# EAGLE board Register_file (EAGLE 9.4.2), part 1 of 2
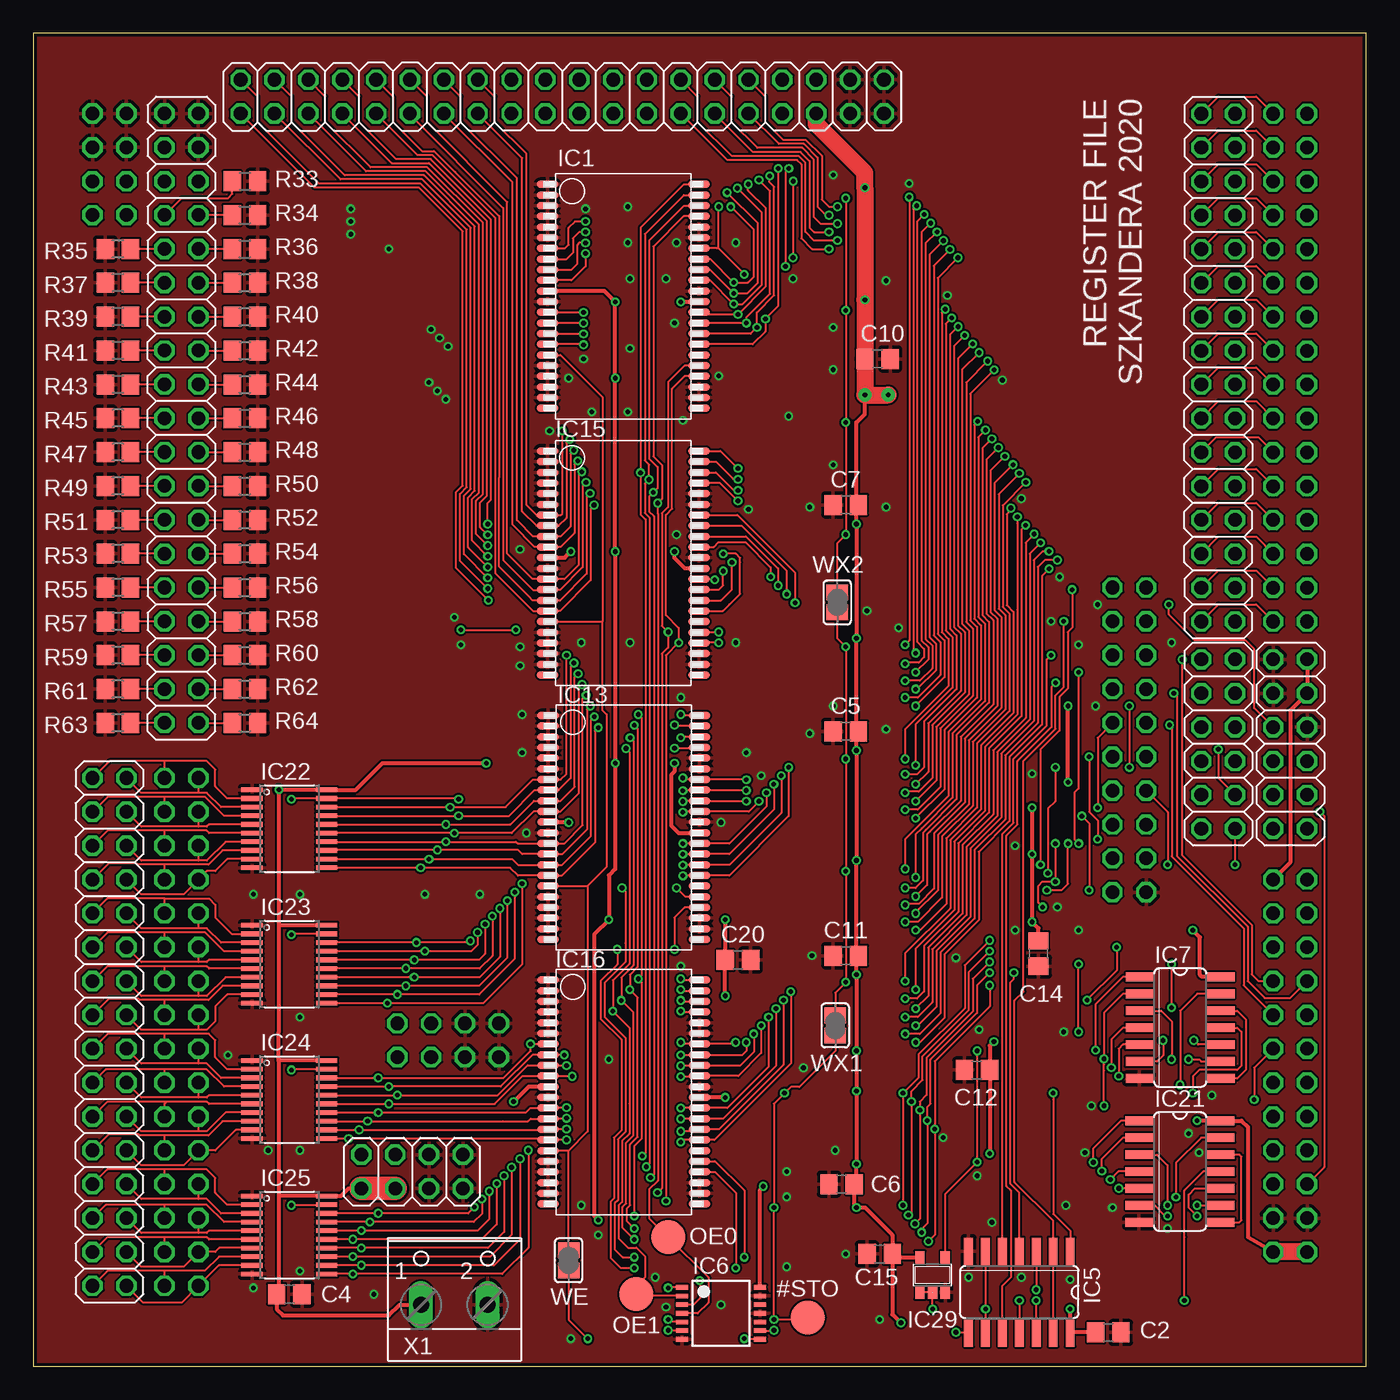
[diagram p2: board, top side]
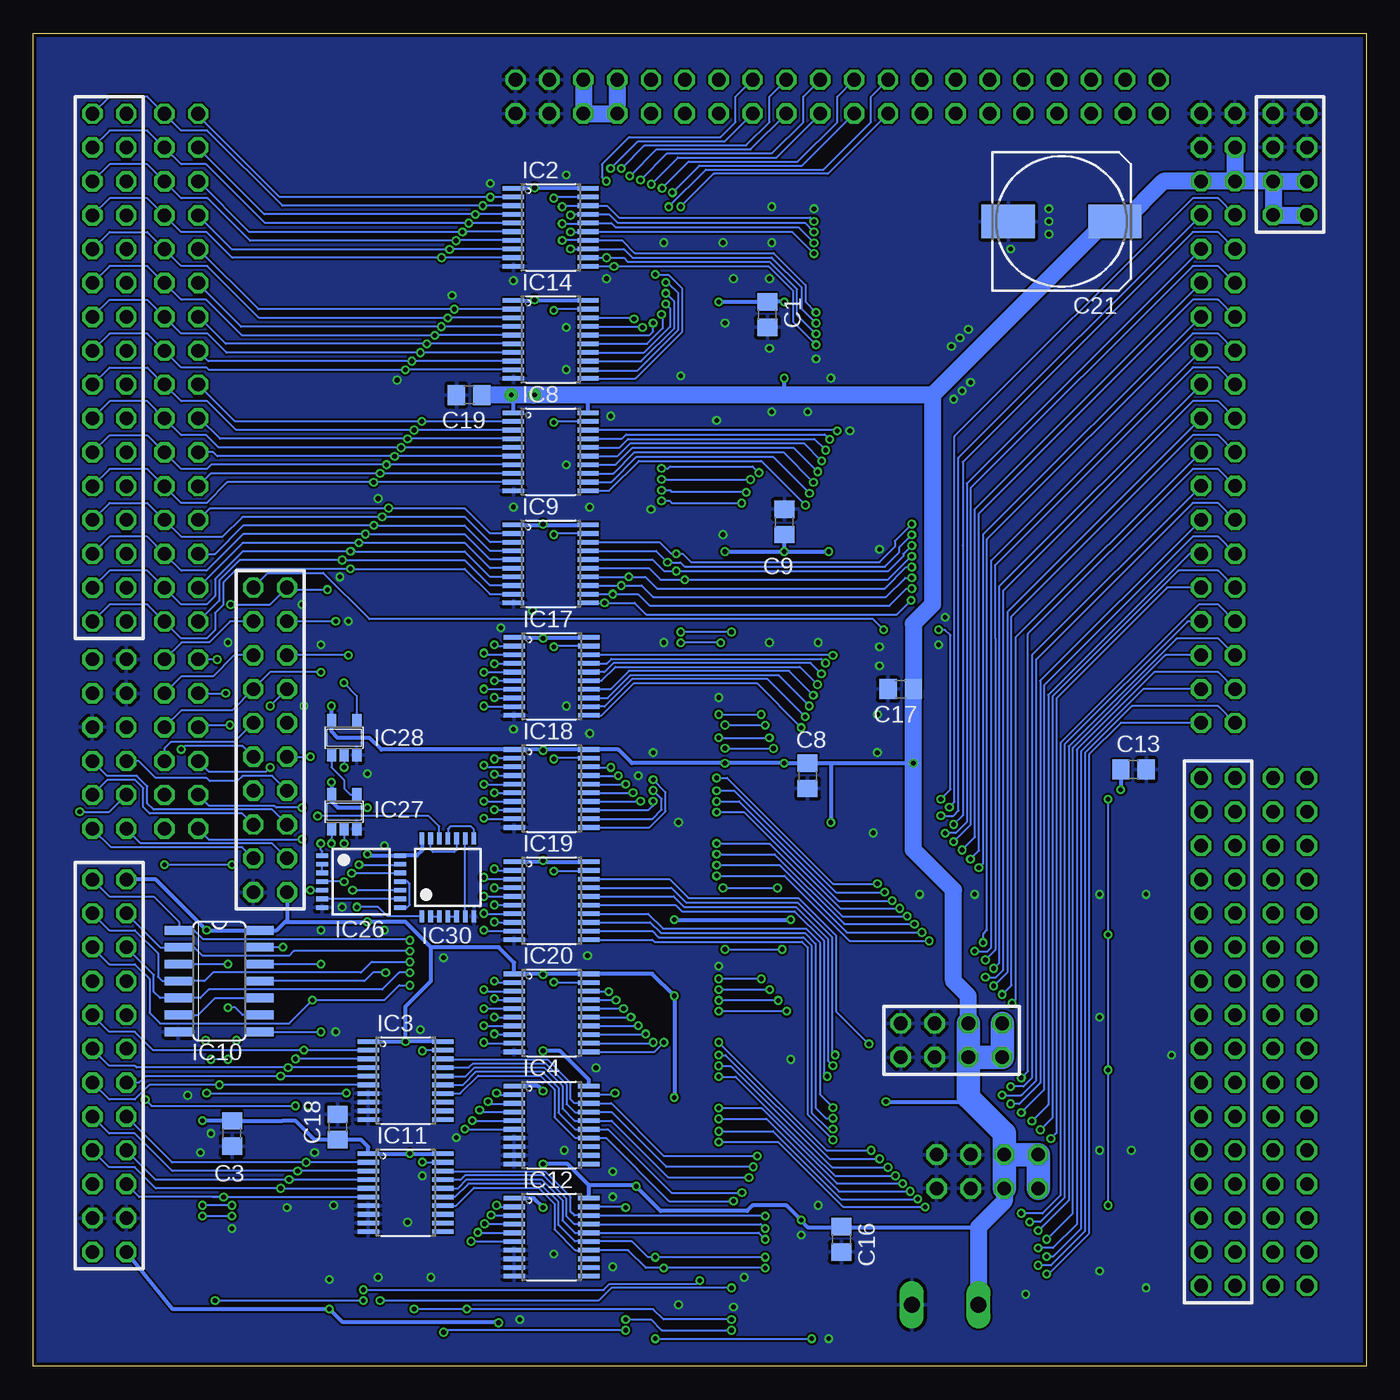
[diagram p3: board, bottom side, seen from below]

Size 100 x 100 mm. Coordinates in mm from the lower left corner, seen from the top.
Outline: 0,0 100,0 100,100 0,100 0,0
Copper layers (1*16): Top 0.035mm / dielectric 1.5mm / Bottom 0.035mm
Design rules "SeeedStudio_2layer_DRU_no_angle_20140221": minimum track width 6mil, minimum drill 12mil, track to track 6mil, track to pad 6mil, pad to pad 6mil, via to via 6mil, smd to smd 0mil, copper to edge 10mil, drill to drill 10mil, minimum pad ring 10mil, minimum via ring 6mil, stop-mask expansion 2mil, vias tented up to drill 100mil, thermal gap 10mil

## Footprints (pad centres in the part's own frame; a part is rotated, then mirrored left to right if it is on the bottom)
B2,54 = smd 2.54 x 2.54: TP 0,0
2X16 = drill 1.016 octagon: 1 -19.05,-1.27; 2 -19.05,1.27; 3 -16.51,-1.27; 4 -16.51,1.27; 5 -13.97,-1.27; 6 -13.97,1.27; 7 -11.43,-1.27; 8 -11.43,1.27; 9 -8.89,-1.27; 10 -8.89,1.27; 11 -6.35,-1.27; 12 -6.35,1.27; 13 -3.81,-1.27; 14 -3.81,1.27; 15 -1.27,-1.27; 16 -1.27,1.27; 17 1.27,-1.27; 18 1.27,1.27; 19 3.81,-1.27; 20 3.81,1.27; 21 6.35,-1.27; 22 6.35,1.27; 23 8.89,-1.27; 24 8.89,1.27; 25 11.43,-1.27; 26 11.43,1.27; 27 13.97,-1.27; 28 13.97,1.27; 29 16.51,-1.27; 30 16.51,1.27; 31 19.05,-1.27; 32 19.05,1.27
C0805 = smd 1.3 x 1.5: 1 -0.95,0; 2 0.95,0
153CLV-1010 = smd 4 x 2.5: + 4,0; - -4,0
TSOP-II-44 = smd 0.55 x 1.6: 1 -8.4,-5.68; 2 -7.6,-5.68; 3 -6.8,-5.68; 4 -6,-5.68; 5 -5.2,-5.68; 6 -4.4,-5.68; 7 -3.6,-5.68; 8 -2.8,-5.68; 9 -2,-5.68; 10 -1.2,-5.68; 11 -0.4,-5.68; 12 0.4,-5.68; 13 1.2,-5.68; 14 2,-5.68; 15 2.8,-5.68; 16 3.6,-5.68; 17 4.4,-5.68; 18 5.2,-5.68; 19 6,-5.68; 20 6.8,-5.68; 21 7.6,-5.68; 22 8.4,-5.68; 23 8.4,5.68; 24 7.6,5.68; 25 6.8,5.68; 26 6,5.68; 27 5.2,5.68; 28 4.4,5.68; 29 3.6,5.68; 30 2.8,5.68; 31 2,5.68; 32 1.2,5.68; 33 0.4,5.68; 34 -0.4,5.68; 35 -1.2,5.68; 36 -2,5.68; 37 -2.8,5.68; 38 -3.6,5.68; 39 -4.4,5.68; 40 -5.2,5.68; 41 -6,5.68; 42 -6.8,5.68; 43 -7.6,5.68; 44 -8.4,5.68
TSSOP20 = smd 0.35 x 1.6: 1 -2.925,-2.8; 2 -2.275,-2.8; 3 -1.625,-2.8; 4 -0.975,-2.8; 5 -0.325,-2.8; 6 0.325,-2.8; 7 0.975,-2.8; 8 1.625,-2.8; 9 2.275,-2.8; 10 2.925,-2.8; 11 2.925,2.8; 12 2.275,2.8; 13 1.625,2.8; 14 0.975,2.8; 15 0.325,2.8; 16 -0.325,2.8; 17 -0.975,2.8; 18 -1.625,2.8; 19 -2.275,2.8; 20 -2.925,2.8
SO14 = smd 0.66 x 2.032: 1 -3.81,-3.073; 2 -2.54,-3.073; 3 -1.27,-3.073; 4 0,-3.073; 5 1.27,-3.073; 6 2.54,-3.073; 7 3.81,-3.073; 8 3.81,3.073; 9 2.54,3.073; 10 1.27,3.073; 11 0,3.073; 12 -1.27,3.073; 13 -2.54,3.073; 14 -3.81,3.073
TSSOP14 = smd 0.35 x 0.9: 1 -1.95,-2.925; 2 -1.3,-2.925; 3 -0.65,-2.925; 4 0,-2.925; 5 0.65,-2.925; 6 1.3,-2.925; 7 1.95,-2.925; 8 1.95,2.925; 9 1.3,2.925; 10 0.65,2.925; 11 0,2.925; 12 -0.65,2.925; 13 -1.3,2.925; 14 -1.95,2.925
SOT23-5 = smd 0.69 x 0.99: 1 -0.95,-1.29; 2 0,-1.29; 3 0.95,-1.29; 4 0.95,1.3; 5 -0.95,1.3
2X12 = drill 1.016 octagon: 1 -13.97,-1.27; 2 -13.97,1.27; 3 -11.43,-1.27; 4 -11.43,1.27; 5 -8.89,-1.27; 6 -8.89,1.27; 7 -6.35,-1.27; 8 -6.35,1.27; 9 -3.81,-1.27; 10 -3.81,1.27; 11 -1.27,-1.27; 12 -1.27,1.27; 13 1.27,-1.27; 14 1.27,1.27; 15 3.81,-1.27; 16 3.81,1.27; 17 6.35,-1.27; 18 6.35,1.27; 19 8.89,-1.27; 20 8.89,1.27; 21 11.43,-1.27; 22 11.43,1.27; 23 13.97,-1.27; 24 13.97,1.27
2X04 = drill 1.016 octagon: 1 -3.81,-1.27; 2 -3.81,1.27; 3 -1.27,-1.27; 4 -1.27,1.27; 5 1.27,-1.27; 6 1.27,1.27; 7 3.81,-1.27; 8 3.81,1.27
R0805 = smd 1.3 x 1.5: 1 -0.95,0; 2 0.95,0
2X20 = drill 1.016 octagon: 1 -24.13,-1.27; 2 -24.13,1.27; 3 -21.59,-1.27; 4 -21.59,1.27; 5 -19.05,-1.27; 6 -19.05,1.27; 7 -16.51,-1.27; 8 -16.51,1.27; 9 -13.97,-1.27; 10 -13.97,1.27; 11 -11.43,-1.27; 12 -11.43,1.27; 13 -8.89,-1.27; 14 -8.89,1.27; 15 -6.35,-1.27; 16 -6.35,1.27; 17 -3.81,-1.27; 18 -3.81,1.27; 19 -1.27,-1.27; 20 -1.27,1.27; 21 1.27,-1.27; 22 1.27,1.27; 23 3.81,-1.27; 24 3.81,1.27; 25 6.35,-1.27; 26 6.35,1.27; 27 8.89,-1.27; 28 8.89,1.27; 29 11.43,-1.27; 30 11.43,1.27; 31 13.97,-1.27; 32 13.97,1.27; 33 16.51,-1.27; 34 16.51,1.27; 35 19.05,-1.27; 36 19.05,1.27; 37 21.59,-1.27; 38 21.59,1.27; 39 24.13,-1.27; 40 24.13,1.27
2X19 = drill 1.016 octagon: 1 -22.86,-1.27; 2 -22.86,1.27; 3 -20.32,-1.27; 4 -20.32,1.27; 5 -17.78,-1.27; 6 -17.78,1.27; 7 -15.24,-1.27; 8 -15.24,1.27; 9 -12.7,-1.27; 10 -12.7,1.27; 11 -10.16,-1.27; 12 -10.16,1.27; 13 -7.62,-1.27; 14 -7.62,1.27; 15 -5.08,-1.27; 16 -5.08,1.27; 17 -2.54,-1.27; 18 -2.54,1.27; 19 0,-1.27; 20 0,1.27; 21 2.54,-1.27; 22 2.54,1.27; 23 5.08,-1.27; 24 5.08,1.27; 25 7.62,-1.27; 26 7.62,1.27; 27 10.16,-1.27; 28 10.16,1.27; 29 12.7,-1.27; 30 12.7,1.27; 31 15.24,-1.27; 32 15.24,1.27; 33 17.78,-1.27; 34 17.78,1.27; 35 20.32,-1.27; 36 20.32,1.27; 37 22.86,-1.27; 38 22.86,1.27
2X10 = drill 1.016 octagon: 1 -11.43,-1.27; 2 -11.43,1.27; 3 -8.89,-1.27; 4 -8.89,1.27; 5 -6.35,-1.27; 6 -6.35,1.27; 7 -3.81,-1.27; 8 -3.81,1.27; 9 -1.27,-1.27; 10 -1.27,1.27; 11 1.27,-1.27; 12 1.27,1.27; 13 3.81,-1.27; 14 3.81,1.27; 15 6.35,-1.27; 16 6.35,1.27; 17 8.89,-1.27; 18 8.89,1.27; 19 11.43,-1.27; 20 11.43,1.27
2X06 = drill 1.016 octagon: 1 -6.35,-1.27; 2 -6.35,1.27; 3 -3.81,-1.27; 4 -3.81,1.27; 5 -1.27,-1.27; 6 -1.27,1.27; 7 1.27,-1.27; 8 1.27,1.27; 9 3.81,-1.27; 10 3.81,1.27; 11 6.35,-1.27; 12 6.35,1.27
SJ = smd 1.168 x 1.6: 1 -0.762,0; 2 0.762,0
W237-102 = drill 1.194 long: 1 -2.5,-1.27; 2 2.5,-1.27

## Placement (x,y rotation side)
#STO  PTR1B2,54  [B2,54]  58.1,3.65 0 top
ALU_Y_C0  [2X16]  11.11,25.08 270 top
ALU_Y_C1  [2X16]  5.71,25.08 270 top
C1  [C0805]  44.93,78.9 270 bottom
C2  [C0805]  80.64,2.54 0 top
C3  [C0805]  85.09,17.46 270 bottom
C4  [C0805]  19.21,5.4 0 top
C5  [C0805]  60.96,47.62 180 top
C6  [C0805]  60.64,13.65 180 top
C7  [C0805]  60.96,64.61 180 top
C8  [C0805]  41.91,44.29 270 bottom
C9  [C0805]  43.66,63.34 90 bottom
C10  [C0805]  63.34,75.56 0 top
C11  [C0805]  60.96,30.8 180 top
C12  [C0805]  70.8,22.23 180 top
C13  [C0805]  17.46,44.77 0 bottom
C14  [C0805]  75.41,30.96 270 top
C15  [C0805]  63.5,8.41 180 top
C16  [C0805]  39.37,9.53 270 bottom
C17  1u  [C0805]  34.92,50.8 180 bottom
C18  1u  [C0805]  77.15,17.94 90 bottom
C19  1u  [C0805]  67.31,72.87 180 bottom
C20  1u  [C0805]  52.86,30.48 0 top
C21  [153CLV-1010]  22.86,85.88 0 bottom
IC1  IS61C6416AL-12T  [TSOP-II-44]  44.26,80.26 270 top
IC2  74245  [TSSOP20]  61.18,85.44 270 bottom
IC3  74245  [TSSOP20]  72.07,21.43 270 bottom
IC4  74245  [TSSOP20]  61.12,18.1 270 bottom
IC5  74HCT08D  [SO14]  73.98,5.56 180 top
IC6  7404  [TSSOP14]  51.59,3.97 270 top
IC7  74HCT32D  [SO14]  86.04,25.4 270 top
IC8  74245  [TSSOP20]  61.18,68.61 270 bottom
IC9  74245  [TSSOP20]  61.18,60.2 270 bottom
IC10  74HCT32D  [SO14]  86.04,28.89 270 bottom
IC11  74245  [TSSOP20]  72.07,13.02 270 bottom
IC12  74245  [TSSOP20]  61.12,9.68 270 bottom
IC13  IS61C6416AL-12T  [TSOP-II-44]  44.31,40.42 270 top
IC14  74245  [TSSOP20]  61.18,77.03 270 bottom
IC15  IS61C6416AL-12T  [TSOP-II-44]  44.26,60.26 270 top
IC16  IS61C6416AL-12T  [TSOP-II-44]  44.31,20.57 270 top
IC17  74245  [TSSOP20]  61.12,51.75 270 bottom
IC18  74245  [TSSOP20]  61.12,43.34 270 bottom
IC19  74245  [TSSOP20]  61.12,34.92 270 bottom
IC20  74245  [TSSOP20]  61.12,26.51 270 bottom
IC21  74HCT32D  [SO14]  86.03,14.61 270 top
IC22  74245  [TSSOP20]  19.21,40.32 270 top
IC23  74245  [TSSOP20]  19.21,30.16 270 top
IC24  74245  [TSSOP20]  19.21,20 270 top
IC25  74245  [TSSOP20]  19.21,9.84 270 top
IC26  7404  [TSSOP14]  75.41,36.35 270 bottom
IC27  74AHC1G08DBV  [SOT23-5]  76.68,41.59 0 bottom
IC28  74AHC1G08DBV  [SOT23-5]  76.68,47.15 0 bottom
IC29  74AHC1G08DBV  [SOT23-5]  67.47,6.83 0 top
IC30  7404  [TSSOP14]  68.9,36.67 0 bottom
INS_C0  [2X12]  94.3,22.54 270 top
OE0  PTR1B2,54  [B2,54]  47.62,9.68 0 top
OE1  PTR1B2,54  [B2,54]  45.24,5.4 0 top
PWR1  [2X04]  5.71,90.17 90 top
PWR2  [2X04]  28.42,14.61 0 top
PWR3  [2X04]  31.11,24.45 0 top
R33  [R0805]  15.88,88.9 0 top
R34  [R0805]  15.88,86.36 0 top
R35  [R0805]  6.35,83.82 180 top
R36  [R0805]  15.88,83.82 0 top
R37  [R0805]  6.35,81.28 180 top
R38  [R0805]  15.88,81.28 0 top
R39  [R0805]  6.35,78.74 180 top
R40  [R0805]  15.88,78.74 0 top
R41  [R0805]  6.35,76.2 180 top
R42  [R0805]  15.88,76.2 0 top
R43  [R0805]  6.35,73.66 180 top
R44  [R0805]  15.88,73.66 0 top
R45  [R0805]  6.35,71.12 180 top
R46  [R0805]  15.88,71.12 0 top
R47  [R0805]  6.35,68.58 180 top
R48  [R0805]  15.88,68.58 0 top
R49  [R0805]  6.35,66.04 180 top
R50  [R0805]  15.88,66.04 0 top
R51  [R0805]  6.35,63.5 180 top
R52  [R0805]  15.88,63.5 0 top
R53  [R0805]  6.35,60.96 180 top
R54  [R0805]  15.88,60.96 0 top
R55  [R0805]  6.35,58.42 180 top
R56  [R0805]  15.88,58.42 0 top
R57  [R0805]  6.35,55.88 180 top
R58  [R0805]  15.88,55.88 0 top
R59  [R0805]  6.35,53.34 180 top
R60  [R0805]  15.88,53.34 0 top
R61  [R0805]  6.35,50.8 180 top
R62  [R0805]  15.88,50.8 0 top
R63  [R0805]  6.35,48.26 180 top
R64  [R0805]  15.88,48.26 0 top
RB0_C0  [2X20]  39.69,95.25 180 top
RB1_C0  [2X19]  11.11,71.12 270 top
RTB_BUS_C0  [2X16]  88.9,74.92 270 top
RTB_BUS_C1  [2X16]  94.3,74.92 270 top
SIGNAL_C0  [2X10]  82.23,46.99 270 top
SIGNAL_C1  [2X06]  88.9,46.67 270 top
SIGNAL_C2  [2X06]  94.3,46.67 270 top
WE  [SJ]  40.16,7.94 90 top
WX1  [SJ]  60.17,25.56 90 top
WX2  [SJ]  60.33,57.31 90 top
X1  [W237-102]  31.59,5.87 0 top

## Tracks (layer width: path | path; a pad name or v marks a point on that pad's centre or on a via)
#ALU_G  (via drill 0.35)
  Top 0.152: v82.23,49.53 v82.23,44.93
  Bottom 0.152: SIGNAL_C0.7 v82.23,49.53 | SIGNAL_C1.7 86.84,44.61 82.55,44.61 v82.23,44.93
#ALU_SRC_RF  (via drill 0.35)
  Top 0.152: v19.37,42.55 19.42,42.6 IC22.19 31.86,42.6 v31.91,42.55 | v19.37,12.06 19.42,12.12 IC25.19 | IC24.19 19.42,22.28 v19.37,22.23 | IC23.19 19.42,32.44 v19.37,32.38 | v32.07,55.24 v36.2,55.24
  Bottom 0.152: v19.37,42.55 v19.37,32.38 v19.37,22.23 v19.37,12.06 | SIGNAL_C0.2 82.41,59.52 78.25,59.52 74.77,56.04 36.99,56.04 v36.2,55.24 | v31.91,42.55 31.18,43.27 31.18,54.84 31.59,55.24 v32.07,55.24
#REG_RTB_G
  Bottom 0.152: SIGNAL_C0.10 84.93,46.83 89.69,46.83 90.17,46.35 SIGNAL_C1.8
#STO  (via drill 0.35)
  Top 0.152: v60.96,87.63 v60.96,79.22 v60.96,70.8 v60.96,62.39 60.33,61.75 WX2.2 WX2.1 60.33,54.61 v60.96,53.98 v60.96,45.56 v60.96,37.15 v60.96,28.8 60.17,28.01 WX1.2 WX1.1 60.17,23.65 57.47,20.95 56.83,20.95 v56.36,20.48 55.56,19.68 v55.56,11.91 v55.56,3.51 57.96,3.51 #STO.TP | v47.62,2.7 48.64,2.7 IC6.6
  Bottom 0.152: IC2.19 60.88,87.71 v60.96,87.63 | v60.96,37.15 58.37,37.15 IC19.19 | IC18.19 60.91,45.61 v60.96,45.56 | IC17.19 60.91,54.03 v60.96,53.98 | IC9.19 60.88,62.47 v60.96,62.39 | IC8.19 60.88,70.89 v60.96,70.8 | IC14.19 60.88,79.3 v60.96,79.22 | v60.96,28.8 60.94,28.79 IC20.19 | v56.36,20.48 56.36,20.37 IC4.19 | v55.56,11.91 55.56,11.96 IC12.19 | v55.56,3.51 53.67,3.51 52.86,2.7 v47.62,2.7
A0  (via drill 0.35)
  Top 0.152: IC15.44 51.56,68.66 v52.86,67.35 | v45.69,15.76 45.94,16.01 45.94,63.53 45.56,63.91 v45.56,67.04 45.56,85.42 48.8,88.66 IC1.44
  Bottom 0.152: v45.56,67.04 46.04,67.51 52.23,67.51 52.39,67.35 v52.86,67.35 | IC3.18 69.23,23.02 61.44,23.02 59.69,21.27 59.69,20 59.41,19.72 IC4.18 56.64,19.72 52.68,15.76 v45.69,15.76
A1  (via drill 0.35)
  Top 0.152: IC15.43 51.2,67.86 52.52,66.55 v52.86,66.55 | IC1.43 48.81,87.86 45.88,84.93 45.88,67.94 46.2,67.63 v46.2,66.52 45.89,66.21 45.89,64.01 46.25,63.65 46.25,15.21 v46,14.96
  Bottom 0.152: v52.86,66.55 52.83,66.52 v46.2,66.52 | IC3.17 67.33,22.41 67.03,22.71 61.56,22.71 59.99,21.15 59.99,19.67 59.37,19.05 58.34,19.05 IC4.17 56.62,19.07 52.51,14.96 v46,14.96
A2  (via drill 0.35)
  Top 0.152: IC15.42 51.21,67.06 52.55,65.72 v52.86,65.72 | IC1.42 48.8,87.06 46.2,84.45 46.2,68.1 46.83,67.47 46.83,65.88 v46.51,65.56 46.2,65.25 46.2,64.14 46.55,63.78 46.55,14.4 v46.3,14.15
  Bottom 0.152: v46.51,65.56 46.58,65.63 52.14,65.63 52.23,65.72 v52.86,65.72 | IC3.16 67.55,21.76 66.9,22.41 61.69,22.41 60.3,21.02 60.3,19.34 59.38,18.42 IC4.16 56.61,18.42 52.33,14.15 v46.3,14.15
A3  (via drill 0.35)
  Top 0.152: IC1.27 48.87,75.06 47.62,73.82 47.62,64.45 47.16,63.99 47.16,55.55 v47.62,55.09 47.62,53.92 47.16,53.45 47.16,13.35 v46.83,13.02 | v51.44,55.09 51.41,55.06 IC15.27
  Bottom 0.152: IC3.15 67.77,21.11 66.77,22.1 61.81,22.1 60.6,20.89 60.6,19.01 59.37,17.77 IC4.15 56.89,17.77 52.13,13.02 v46.83,13.02 | v47.62,55.09 v51.44,55.09
A4  (via drill 0.35)
  Top 0.152: IC1.26 48.86,74.26 47.93,73.33 47.93,64.33 47.47,63.86 47.47,56.34 48.42,55.39 v48.42,54.28 47.47,53.33 v47.47,12.38 | v51.44,54.28 49.96,54.28 IC15.26
  Bottom 0.152: IC3.14 67.97,20.46 66.62,21.8 61.94,21.8 60.91,20.77 60.91,18.68 59.35,17.12 IC4.14 57.05,17.12 52.31,12.38 v47.47,12.38 | v48.42,54.28 v51.44,54.28
A10  (via drill 0.35)
  Top 0.152: IC13.44 48.66,48.82 v48.58,48.9 | v45.39,48.9 45.64,48.64 45.64,29.3 v45.39,29.05 45.64,28.8 45.64,19.21 45.64,17.06 45.24,16.67 45.09,16.51 v45.09,11.27 | v48.58,29.05 48.66,28.97 IC16.44
  Bottom 0.152: IC11.18 69.24,14.61 61.6,14.61 59.69,12.7 59.69,11.59 59.41,11.31 IC12.18 58.28,11.27 v45.09,11.27 | v48.58,48.9 v45.39,48.9 | v45.39,29.05 v48.58,29.05
A11  (via drill 0.35)
  Top 0.152: IC13.43 48.19,48.02 v48.1,48.1 | v45.08,48.09 45.33,47.84 45.33,29.94 44.75,29.36 v44.75,28.24 45.33,27.66 45.33,17.19 44.78,16.64 44.78,12.08 44.53,11.83 44.53,10.88 v45.09,10.32 | v48.58,28.24 48.65,28.17 IC16.43
  Bottom 0.152: IC11.17 69.25,13.97 67.94,13.97 67.61,14.3 61.73,14.3 59.99,12.57 59.99,11.26 59.4,10.66 IC12.17 45.42,10.66 v45.09,10.32 | v48.1,48.1 45.09,48.1 v45.08,48.09 | v44.75,28.24 v48.58,28.24
A12  (via drill 0.35)
  Top 0.152: IC13.42 48.65,47.22 v48.58,47.15 | v44.78,47.15 45.03,46.9 45.03,30.07 44.12,29.16 v44.12,27.44 45.03,26.52 45.03,17.32 44.48,16.76 44.48,12.2 44.22,11.95 44.22,10.37 v45.09,9.51 | v48.58,27.44 48.64,27.37 IC16.42
  Bottom 0.152: IC11.16 68.14,13.34 67.48,14 61.85,14 60.3,12.45 60.3,10.93 59.37,10 IC12.16 45.58,10.01 v45.09,9.51 | v48.58,47.15 v44.78,47.15 | v44.12,27.44 v48.58,27.44
A13  (via drill 0.35)
  Top 0.152: IC13.27 48.92,35.22 v48.26,35.88 | v44.17,35.88 44.42,35.63 44.42,31.75 44.42,30.32 43.64,29.54 42.86,28.77 42.86,26.67 42.86,26.19 43.5,25.56 44.42,24.64 44.42,17.57 43.87,17.02 43.87,12.46 43.62,12.21 43.62,8.77 44.21,8.18 v45.09,8.18 | IC16.27 51.14,15.37 53.34,13.18 v53.34,8.18
  Bottom 0.152: IC11.15 68.36,12.69 67.36,13.7 61.98,13.7 60.6,12.32 60.6,10.6 59.37,9.36 IC12.15 55.09,9.37 53.9,8.18 v53.34,8.18 v45.09,8.18 | v48.26,35.88 v44.17,35.88
A14  (via drill 0.35)
  Top 0.152: IC13.26 48.86,34.42 48.1,33.66 v48.1,31.27 | v43.81,31.27 43.81,30.15 42.56,28.89 42.56,26.07 44.11,24.51 44.11,17.69 43.56,17.14 43.56,12.58 43.31,12.33 43.31,8.12 44.07,7.37 v45.09,7.37 | IC16.26 51.15,14.57 52.7,13.02 v52.7,7.37
  Bottom 0.152: IC11.14 68.28,12.04 66.94,13.39 62.1,13.39 60.91,12.2 60.91,10.27 59.35,8.71 IC12.14 55.38,8.71 54.04,7.37 v52.7,7.37 v45.09,7.37 | v48.1,31.27 v43.81,31.27
ALU_OP_0
  Bottom 0.152: SIGNAL_C0.18 84.32,38.92 94.16,38.92 SIGNAL_C2.12
ALU_OP_1
  Bottom 0.152: SIGNAL_C0.16 84.32,41.46 91.26,41.46 91.75,41.94 91.75,43.37 92.36,43.99 94.44,43.99 SIGNAL_C2.10
ALU_Y_0
  Top 0.152: IC22.2 14.55,42.6 13.65,43.5 13.65,44.77 13.02,45.4 9.84,45.4 | 9.84,45.4 5.71,45.4 ALU_Y_C1.1 | ALU_Y_C0.1 9.84,45.4
ALU_Y_1
  Top 0.152: IC22.3 14.09,41.95 13.02,43.02 12.38,43.02 | 12.38,43.02 8.1,43.02 ALU_Y_C1.2 | ALU_Y_C0.2 12.38,43.02
ALU_Y_2
  Top 0.152: IC22.4 14.31,41.3 12.89,42.72 9.84,42.72 | 9.84,42.72 5.57,42.72 ALU_Y_C1.3 | ALU_Y_C0.3 9.84,42.72
ALU_Y_3
  Top 0.152: IC22.5 13.18,40.65 13.02,40.48 12.38,40.48 | 12.38,40.48 8.1,40.48 ALU_Y_C1.4 | ALU_Y_C0.4 12.38,40.48
ALU_Y_4
  Top 0.152: IC22.6 13.18,40 13.01,40.18 9.84,40.18 | ALU_Y_C1.5 5.57,40.18 9.84,40.18 | ALU_Y_C0.5 9.84,40.18
ALU_Y_5
  Top 0.152: IC22.7 14.42,39.35 13.02,37.94 12.38,37.94 | 12.38,37.94 8.1,37.94 ALU_Y_C1.6 | ALU_Y_C0.6 12.38,37.94
ALU_Y_6
  Top 0.152: IC22.8 14.21,38.7 13.14,37.64 9.84,37.64 | ALU_Y_C1.7 5.66,37.73 7.72,37.73 7.81,37.64 9.84,37.64 | ALU_Y_C0.7 9.84,37.64
ALU_Y_7
  Top 0.152: IC22.9 14.55,38.05 13.65,37.15 13.02,37.15 ALU_Y_C0.8 11.27,35.4 8.1,35.4 ALU_Y_C1.8
ALU_Y_8
  Top 0.152: 9.84,35.08 5.56,35.08 ALU_Y_C1.9 | ALU_Y_C0.9 9.84,35.08 | 9.84,35.08 13.18,35.08 13.65,34.61 13.65,33.66 14.87,32.44 IC23.2
ALU_Y_9
  Top 0.152: IC23.3 14.09,31.79 13.02,32.86 12.38,32.86 | 12.38,32.86 8.1,32.86 ALU_Y_C1.10 | ALU_Y_C0.10 12.38,32.86
ALU_Y_10
  Top 0.152: IC23.4 14.31,31.14 12.89,32.56 9.84,32.56 | 9.84,32.56 5.57,32.56 ALU_Y_C1.11 | ALU_Y_C0.11 9.84,32.56
ALU_Y_11
  Top 0.152: IC23.5 13.18,30.49 13.02,30.32 12.38,30.32 | 12.38,30.32 8.1,30.32 ALU_Y_C1.12 | ALU_Y_C0.12 12.38,30.32
ALU_Y_12
  Top 0.152: IC23.6 13.18,29.84 13.02,30 9.84,30 | 9.84,30 5.56,30 ALU_Y_C1.13 | ALU_Y_C0.13 9.84,30
ALU_Y_13
  Top 0.152: IC23.7 14.42,29.19 13.02,27.78 12.38,27.78 | 12.38,27.78 8.1,27.78 ALU_Y_C1.14 | ALU_Y_C0.14 12.38,27.78
ALU_Y_14
  Top 0.152: IC23.8 14.21,28.54 13.14,27.48 9.84,27.48 | ALU_Y_C1.15 5.66,27.57 7.88,27.57 7.97,27.48 9.84,27.48 | ALU_Y_C0.15 9.84,27.48
ALU_Y_15
  Top 0.152: IC23.9 14.55,27.89 13.65,26.99 13.65,25.88 13.02,25.24 12.38,25.24 | 12.38,25.24 8.1,25.24 ALU_Y_C1.16 | ALU_Y_C0.16 12.38,25.24
ALU_Y_16
  Top 0.152: IC24.2 14.55,22.28 13.65,23.18 13.65,24.45 13.16,24.94 9.84,24.94 | ALU_Y_C1.17 5.57,24.94 9.84,24.94 | ALU_Y_C0.17 9.84,24.94
ALU_Y_17
  Top 0.152: IC24.3 14.09,21.63 13.02,22.7 12.38,22.7 | 12.38,22.7 8.1,22.7 ALU_Y_C1.18 | ALU_Y_C0.18 12.38,22.7
ALU_Y_18
  Top 0.152: IC24.4 14.31,20.98 13.03,22.26 9.84,22.26 | 9.84,22.26 5.44,22.26 ALU_Y_C1.19 | ALU_Y_C0.19 9.84,22.26
ALU_Y_19
  Top 0.152: IC24.5 13.18,20.33 13.02,20.16 12.38,20.16 | 12.38,20.16 8.1,20.16 ALU_Y_C1.20 | ALU_Y_C0.20 12.38,20.16
ALU_Y_20
  Top 0.152: IC24.6 13.18,19.68 13.02,19.84 10,19.84 | 10,19.84 5.56,19.84 ALU_Y_C1.21 | ALU_Y_C0.21 9.84,19.68 10,19.84
ALU_Y_21
  Top 0.152: IC24.7 14.42,19.03 13.02,17.62 12.38,17.62 | 12.38,17.62 8.1,17.62 ALU_Y_C1.22 | ALU_Y_C0.22 12.38,17.62
ALU_Y_22
  Top 0.152: IC24.8 14.21,18.38 13.14,17.32 9.84,17.32 | ALU_Y_C1.23 5.66,17.41 7.88,17.41 7.97,17.32 9.84,17.32 | ALU_Y_C0.23 9.84,17.32
ALU_Y_23
  Top 0.152: IC24.9 15.19,17.73 13.65,16.19 ALU_Y_C0.24 11.27,15.08 8.1,15.08 ALU_Y_C1.24
ALU_Y_24
  Top 0.152: IC25.2 14.55,12.12 13.65,13.02 13.65,14.13 13.02,14.76 9.84,14.76 | 9.84,14.76 5.56,14.76 ALU_Y_C1.25 | ALU_Y_C0.25 9.84,14.76
ALU_Y_25
  Top 0.152: IC25.3 14.09,11.47 13.02,12.54 12.38,12.54 | 12.38,12.54 8.1,12.54 ALU_Y_C1.26 | ALU_Y_C0.26 12.38,12.54
ALU_Y_26
  Top 0.152: IC25.4 14.31,10.82 13.03,12.1 9.84,12.1 | 9.84,12.1 5.44,12.1 ALU_Y_C1.27 | ALU_Y_C0.27 9.84,12.1
ALU_Y_27
  Top 0.152: IC25.5 13.18,10.17 13.02,10 12.38,10 | 12.38,10 8.1,10 ALU_Y_C1.28 | ALU_Y_C0.28 12.38,10
ALU_Y_28
  Top 0.152: IC25.6 13.18,9.52 13.02,9.68 9.84,9.68 | 9.84,9.68 5.56,9.68 ALU_Y_C1.29 | ALU_Y_C0.29 9.84,9.68
ALU_Y_29
  Top 0.152: IC25.7 13.95,8.87 13.65,8.57 ALU_Y_C0.30 11.27,7.46 8.1,7.46 ALU_Y_C1.30
ALU_Y_30
  Top 0.152: IC25.8 13.93,8.22 12.87,7.16 9.84,7.16 | ALU_Y_C1.31 5.57,7.16 9.84,7.16 | ALU_Y_C0.31 9.84,7.16
ALU_Y_31
  Top 0.152: IC25.9 13.92,7.57 ALU_Y_C0.32 11.11,4.76 8.26,4.76 ALU_Y_C1.32
BRANCH
  Bottom 0.152: SIGNAL_C0.15 82.09,41.76 90.98,41.76 91.44,42.23 91.44,43.5 92.23,44.29 94.46,44.29 SIGNAL_C2.8
CLK  (via drill 0.35)
  Top 0.152: v78.42,52.07 78.42,43.34 78.12,43.03 78.12,39.53 v78.44,39.21
  Bottom 0.152: SIGNAL_C1.6 88.9,49.21 85.09,49.21 SIGNAL_C0.8 82.23,52.07 v78.42,52.07 | IC26.1 78.33,38.63 78.44,38.73 v78.44,39.21
GND  (via drill 0.35)
  other vias: 79.69,49.53 73.66,39.05 73.66,32.7 78.42,32.7 77.31,25.08 69.22,30.64 78.9,16.03 70.8,14.29 68.26,17.14 86.68,17.46 88.42,20.32 85.09,10.32 71.91,10.79 77.47,12.06 63.5,3.49 77.79,6.51 70.17,6.67 60.96,8.41 56.52,7.46 51.59,4.6 46.67,6.67 47.47,4.45 40.32,2.06 42.39,9.84 41.12,12.06 16.51,5.87 20,7.14 25.56,5.4 20,16.19 17.62,16.19 14.61,23.34 20,26.19 16.51,35.4 20,35.4 29.37,35.4 33.5,35.4 36.99,40.01 48.58,50.16 53.5,46.04 54.61,44.29 36.67,48.9 36.67,46.04 36.51,52.55 36.51,53.98 31.59,56.2 41.12,54.29 44.77,54.29 52.7,54.29 60.01,49.53 63.98,47.78 58.26,47.47 62.55,56.67 64.93,55.4 63.98,64.45 58.26,64.45 53.66,64.29 48.26,62.39 48.74,70.96 51.44,74.3 48.1,78.26 44.77,76.36 41.27,75.56 44.77,81.6 47.47,81.6 44.61,84.3 48.26,84.3 31.11,76.52 30.48,77.15 29.84,77.79 29.69,73.82 30.32,73.18 30.96,72.55 41.43,86.84 44.61,87 52.7,84.3 56.99,81.6 60.01,89.38 63.98,81.44 72.71,73.98 36.51,61.28 32.07,54.13 38.73,70.17 40.16,74.14 41.91,71.6 44.61,71.6 60.01,77.95 60.01,74.77 56.67,71.28 60.01,67.63 68.58,80.33 65.72,88.74 74.14,65.09 76.99,59.21 76.36,55.88 78.42,54.13 76.83,34.45 80.96,11.91 87.47,16.03 79.38,19.53 70.96,25.24 48.58,30 58.42,30.8 57.78,22.38 56.52,14.61 56.52,12.7 60.17,16.19 74.14,6.67 51.59,40.8 43.18,23.02 74.93,44.45 79.85,57.15 85.41,54.29 23.81,86.84 23.81,85.88 23.81,84.93 26.67,83.82
  pour Top: -6.83,107.95 107.16,107.95 107.16,43.02 107.16,-7.78 42.55,-7.78 -6.83,-7.78
  pour Bottom: -8.1,109.38 -8.1,-9.53 104.78,-9.53 108.11,-9.53 108.11,-5.08 108.11,109.38
INS_F3_0  (via drill 0.35)
  Top 0.152: v86.2,53.02 86.2,38.33 91.42,33.11 91.42,29.39 91.92,28.89 INS_C0.7
  Bottom 0.152: v86.2,53.02 SIGNAL_C1.1
INS_F3_1  (via drill 0.35)
  Top 0.152: v85.57,50.48 85.81,50.24 85.81,38.29 91.11,32.99 91.11,28.91 92.39,27.62 94.3,27.62 INS_C0.8
  Bottom 0.152: SIGNAL_C1.3 v85.57,50.48
INS_F3_2  (via drill 0.35)
  Top 0.152: v85.25,48.1 85.41,47.94 85.41,38.26 90.81,32.86 90.81,28.57 INS_C0.9
  Bottom 0.152: v85.25,48.1 87.47,48.1 SIGNAL_C1.5
INS_I  (via drill 0.35)
  Top 0.152: INS_C0.20 96.84,14.92 96.84,41.27 v96.52,41.59
  Bottom 0.152: v96.52,41.59 94.3,41.59 SIGNAL_C2.9
INS_R1_0  (via drill 0.35)
  Top 0.152: IC7.1 81.76,29.21 79.69,27.15 v79.69,23.71
  Bottom 0.152: IC3.2 v79.69,23.71 91.02,23.71 92.39,25.08 94.3,25.08 INS_C0.10
INS_R1_1  (via drill 0.35)
  Top 0.152: IC7.2 81.76,27.94 80.33,26.51 v80.33,23.06 v80.33,23.05 80.33,22.64 80.33,22.18 v80.33,19.53 | INS_C0.11 91.6,22.38 v91.6,20
  Bottom 0.152: IC3.3 v80.33,23.06 | v91.6,20 91.12,19.53 v80.33,19.53
INS_R1_2  (via drill 0.35)
  Top 0.152: IC7.4 81.76,25.4 80.88,24.53 v80.88,22.41
  Bottom 0.152: IC3.4 v80.88,22.41 92.26,22.41 92.39,22.54 94.3,22.54 INS_C0.12
INS_R1_3  (via drill 0.35)
  Top 0.152: IC7.5 81.76,24.13 81.44,23.81 v81.44,21.76
  Bottom 0.152: IC3.5 v81.44,21.76 91.59,21.76 92.08,21.27 INS_C0.13
INS_R1_4  (via drill 0.35)
  Top 0.152: IC7.13 87.31,27.94 86.04,26.67 v86.04,21.11
  Bottom 0.152: IC3.6 v86.04,21.11 91.29,21.11 92.39,20 94.3,20 INS_C0.14
INS_R2_0  (via drill 0.35)
  Top 0.152: IC21.1 81.6,18.41 79.53,16.35 v79.53,15.29
  Bottom 0.152: IC11.2 v79.53,15.29 89.59,15.29 INS_C0.15
INS_R2_1  (via drill 0.35)
  Top 0.152: IC21.2 81.76,17.14 80.17,15.56 v80.17,14.64
  Bottom 0.152: IC11.3 v80.17,14.64 89.57,14.64 92.39,17.46 94.3,17.46 INS_C0.16
INS_R2_2  (via drill 0.35)
  Top 0.152: IC21.4 81.42,14.61 v80.8,13.99
  Bottom 0.152: IC11.4 v80.8,13.99 90.83,13.99 INS_C0.17
INS_R2_3  (via drill 0.35)
  Top 0.152: IC21.5 v81.45,13.34 v81.44,13.34
  Bottom 0.152: IC11.5 v81.44,13.34 90.81,13.34 92.39,14.92 94.3,14.92 INS_C0.18
INS_R2_4  (via drill 0.35)
  Top 0.152: IC21.13 87.63,17.14 85.72,15.24 v85.72,12.69
  Bottom 0.152: 86.52,12.69 IC11.6 | v85.72,12.69 86.52,12.69 | 86.52,12.69 92.07,12.69 INS_C0.19
INS_WR_0  (via drill 0.35)
  Top 0.152: v65.25,12.06 v65.25,20.48 66.41,21.64 66.41,23.39 69.88,26.85 69.88,30.07 v71.75,31.95
  Bottom 0.152: v65.25,20.48 65.14,20.37 IC4.2 | v65.25,12.06 65.14,11.96 IC12.2 | INS_C0.2 94.3,35.24 90.96,35.24 89.06,33.34 89.06,32.7 | 89.06,32.7 87.95,32.7 87.31,32.07 71.87,32.07 v71.75,31.95 | 89.06,32.7 IC10.1
INS_WR_1  (via drill 0.35)
  Top 0.152: v65.66,11.34 65.88,11.56 v65.88,19.84 65.88,20.64 66.71,21.47 66.71,23.26 70.18,26.73 70.18,29.57 v71.75,31.14
  Bottom 0.152: IC4.3 63.96,19.68 65.72,19.68 v65.88,19.84 | v65.66,11.34 63.95,11.34 IC12.3 | v71.75,31.14 80.46,31.14 80.8,30.8 87.31,30.8 87.95,31.43 IC10.2 90.49,31.43 INS_C0.3
INS_WR_2  (via drill 0.35)
  Top 0.152: v66.15,10.69 66.52,11.05 v66.52,19.21 66.52,19.84 67.02,20.35 67.02,23.14 70.48,26.6 70.48,29.07 v71.75,30.34
  Bottom 0.152: v66.52,19.21 66.38,19.07 IC4.4 | v66.15,10.69 63.95,10.69 IC12.4 | v71.75,30.34 74.61,30.34 75.42,29.53 86.52,29.53 87.15,28.89 IC10.4 90.33,28.89 90.65,29.21 90.65,30.96 92.39,32.7 94.3,32.7 INS_C0.4
INS_WR_3  (via drill 0.35)
  Top 0.152: v66.64,10.04 66.64,10.29 67.07,10.72 v67.07,18.41 67.07,19.45 67.32,19.7 67.32,23.01 70.8,26.49 70.8,28.57 v71.75,29.53
  Bottom 0.152: IC4.5 v67.07,18.41 | v66.64,10.04 66.61,10.01 IC12.5 | v71.75,29.53 72.55,29.53 73.82,28.26 86.84,28.26 87.47,27.62 IC10.5 90.49,27.62 90.96,28.1 90.96,29.37 INS_C0.5
INS_WR_4  (via drill 0.35)
  Top 0.152: v71.75,28.57 71.75,27.01 67.63,22.88 v67.63,17.78 67.63,9.84 v67.15,9.37 | v81.28,31.43 81.28,29.69 v79.06,27.46
  Bottom 0.152: IC4.6 v67.63,17.78 | v71.75,28.57 72.55,28.57 73.66,27.46 v79.06,27.46 80.8,25.72 85.1,25.72 90.49,25.72 91.28,26.51 91.28,29.05 92.39,30.16 94.3,30.16 INS_C0.6 | IC12.6 v67.15,9.37 | v81.28,31.43 IC10.13
IS_ZERO  (via drill 0.35)
  Top 0.152: IC5.4 73.98,13.02 73.32,13.68 73.32,28.8 73.57,29.05 v73.57,29.53
  Bottom 0.152: v73.57,29.53 74.52,29.53 75.16,28.89 IC10.11
IS_ZERO_R1  (via drill 0.35)
  Top 0.152: IC7.11 90.33,25.4 90.65,25.08 90.65,22.54 90.33,22.23 87.47,22.23 87,21.75 v87,20.48 | v76.52,20.48 76.52,20 76.52,11.43 77.79,10.16 IC5.1
  Bottom 0.152: v87,20.48 v76.52,20.48
IS_ZERO_R2  (via drill 0.35)
  Top 0.152: IC21.11 87.79,14.61 86.37,13.19 86.37,9.7 86.36,9.68 v86.36,4.92 | IC5.12 v75.25,4.92
  Bottom 0.152: v75.25,4.92 v86.36,4.92
LTCH_CLK  (via drill 0.35)
  Top 0.152: SIGNAL_C0.9 79.85,47.15 v79.85,41.91
  Bottom 0.152: v79.85,41.91 81.76,41.91 81.92,42.07 86.84,42.07 SIGNAL_C1.9
M0_OE  (via drill 0.35)
  Top 0.152: IC1.41 48.8,86.26 46.53,83.99 46.53,68.25 47.16,67.61 47.16,65.07 v46.85,64.75 46.85,63.96 46.86,63.95 46.86,13.92 46.2,13.26 46.2,11.11 OE0.TP 50.64,6.67 50.64,4.76 49.85,3.97 IC6.4 | v52.86,64.92 51.52,66.26 IC15.41
  Bottom 0.152: v46.85,64.75 52.09,64.75 52.25,64.92 v52.86,64.92
M0_WE  (via drill 0.35)
  Top 0.152: IC1.17 39.55,75.86 42.7,72.71 42.7,55.88 42.69,55.86 | IC15.17 42.69,55.86 | 42.69,55.86 42.69,49.23 43.02,48.9 43.02,37.47 41.57,36.02 | IC13.17 41.57,36.02 | 41.57,36.02 41.59,36 41.59,17.6 40.16,16.17 | 40.16,16.17 IC16.17 | IC6.8 53.38,2.02 v53.34,2.06 | 40.16,16.17 WE.2 WE.1 40.16,3.49 v41.59,2.06
  Bottom 0.152: v53.34,2.06 v41.59,2.06
M1_OE  (via drill 0.35)
  Top 0.152: IC13.41 49.93,46.35 v48.1,46.35 | v44.47,46.34 44.72,46.09 44.72,30.2 43.48,28.95 v43.48,26.63 44.72,25.39 44.72,19.68 44.72,17.44 44.17,16.89 44.17,12.33 43.92,12.08 43.92,10.21 43.92,9.58 44.61,8.89 45.24,8.89 45.88,8.26 45.88,6.67 45.24,6.03 OE1.TP 45.37,5.27 IC6.2 | v48.58,26.63 48.63,26.57 IC16.41
  Bottom 0.152: v48.1,46.35 48.09,46.34 v44.47,46.34 | v43.48,26.63 v48.58,26.63
MEM_LOAD
  Bottom 0.152: SIGNAL_C0.6 84.93,53.34 86.52,51.75 88.9,51.75 SIGNAL_C1.4
MEM_STORE
  Bottom 0.152: SIGNAL_C0.4 85.25,55.88 86.82,54.3 88.89,54.3 SIGNAL_C1.2
N$1  (via drill 0.35)
  Top 0.152: v85.41,23.02 85.41,25.88 84.61,26.67 IC7.3 | v86.68,23.02 87.47,23.02 87.63,22.86 IC7.9
  Bottom 0.152: v85.41,23.02 v86.68,23.02
N$2  (via drill 0.35)
  Top 0.152: IC7.10 87.39,24.13 v87.08,24.45 | v84.77,24.45 84.77,23.34 84.3,22.86 IC7.6
  Bottom 0.152: v87.08,24.45 v84.77,24.45
N$3  (via drill 0.35)
  Top 0.152: v85.41,26.91 v85.41,30.16
  Bottom 0.152: IC10.9 84.3,26.35 84.85,26.91 v85.41,26.91 | v85.41,30.16 IC10.3
N$4
  Bottom 0.152: IC10.6 87.63,26.35 86.36,27.62 IC10.10
N$5  (via drill 0.35)
  Top 0.152: v78.42,25.08 v78.42,30.16
  Bottom 0.152: IC10.8 v78.42,25.08 | v78.42,30.16 IC10.12
N$6
  Top 0.152: IC7.12 90.33,26.67 90.96,26.04 90.96,22.23 90.33,21.59 IC7.8
N$7  (via drill 0.35)
  Top 0.152: IC5.3 v75.25,5.73 | v50.01,6.43 50.01,5.08 49.55,4.62 IC6.3
  Bottom 0.152: v75.25,5.73 57.21,5.73 56.76,6.18 50.26,6.18 v50.01,6.43
N$8  (via drill 0.35)
  Top 0.152: IC6.9 55.53,2.67 v55.56,2.7 | v69.22,2.54 70.11,2.54 IC5.8
  Bottom 0.152: v55.56,2.7 69.06,2.7 v69.22,2.54
N$9  (via drill 0.35)
  Top 0.152: IC21.3 84.3,15.88 85.09,15.08 v85.09,12.06 | v87.31,12.06 87.95,12.06 IC21.9
  Bottom 0.152: v85.09,12.06 v87.31,12.06
N$10  (via drill 0.35)
  Top 0.152: IC21.10 87.15,13.34 86.68,12.86 86.68,11.89 v87.31,11.26 | IC21.6 84.14,12.06 84.94,11.26 v85.09,11.26
  Bottom 0.152: v85.09,11.26 v87.31,11.26
N$11
  Top 0.152: IC21.8 90.49,10.79 90.65,10.95 90.65,15.72 90.49,15.88 IC21.12
N$12  (via drill 0.35)
  Top 0.152: IC6.1 47.67,5.92 v47.62,5.87 | v73.98,4.92 IC5.11
  Bottom 0.152: v47.62,5.87 56.63,5.87 57.59,4.92 v73.98,4.92
N$13
  Bottom 0.152: IC30.2 IC30.3
N$14
  Bottom 0.152: IC30.4 IC30.5
N$15
  Bottom 0.152: IC30.6 IC30.9
N$16
  Bottom 0.152: IC26.3 IC26.2
N$17  (via drill 0.35)
  Top 0.152: v76.68,39.21 v76.68,36.35 75.72,36.35 75.41,36.04 75.41,34.77 v75.72,34.45
  Bottom 0.152: IC27.2 v76.68,39.21 | v76.68,36.35 IC26.4 | IC30.1 73.43,33.75 74.14,34.45 v75.72,34.45
N$18
  Bottom 0.152: IC26.9 IC26.6
N$19
  Bottom 0.152: IC26.8 71.96,34.4 71.75,34.61 71.75,36.2 71.91,36.35 IC26.11
N$20  (via drill 0.35)
  Top 0.152: v76.04,35.72 77.15,35.72 77.63,36.2 v77.63,39.21
  Bottom 0.152: IC27.1 v77.63,39.21 | IC26.10 76.03,35.7 v76.04,35.72
N$21
  Bottom 0.152: IC28.1 77.63,44.93 76.68,43.98 76.68,43.34 76.23,42.89 IC27.4
N$22  (via drill 0.35)
  Top 0.152: v76.68,44.93 76.68,42.39 76.12,41.83 v76.12,36.99
  Bottom 0.152: IC28.2 v76.68,44.93 | v76.12,36.99 72.5,36.99 IC26.12
N$23
  Bottom 0.152: IC30.8 66.95,40.28 67.15,40.48 68.74,40.48 68.9,40.32 IC30.11
N$24
  Bottom 0.152: IC30.10 68.25,38.75 68.42,38.58 70.01,38.58 70.2,38.77 IC30.13
N$25  (via drill 0.35)
  Top 0.152: v78.67,41.27 79.22,40.73 v79.22,35.72
  Bottom 0.152: IC30.12 69.55,40.5 70.33,41.27 v78.67,41.27 | v79.22,35.72 79.2,35.7 IC26.5
PCE  (via drill 0.35)
  Top 0.152: v77.95,58.26 77.95,55.4 77.62,55.07 77.62,50.83 77,50.21 77,47.69 75.56,46.26 v75.56,37.62 | SIGNAL_C2.5 91.6,49.37 91.6,53.82 90.96,54.45 87.15,54.45 85.19,56.41 v85.19,57.15
  Bottom 0.152: v77.95,58.26 80.8,58.26 SIGNAL_C0.1 82.23,57.15 v85.19,57.15 | v75.56,37.62 72.51,37.62 IC26.13
RB0_0  (via drill 0.35)
  Top 0.152: IC1.7 39.89,83.86 40.16,84.14 40.16,85.41 40.64,85.88 41.42,85.88 v41.43,85.9 | v60.33,87 59.69,87 59.15,87.53 59.15,90.8 57.94,92.01 56.26,92.01 54.93,93.34 54.93,95.25 RB0_C0.9
  Bottom 0.152: v41.43,85.9 41.71,86.17 56.06,86.17 56.95,87.06 IC2.18 60.26,87.06 v60.33,87
RB0_1  (via drill 0.35)
  Top 0.152: v41.43,85.09 40.96,85.09 40.48,84.61 40.48,83.54 40.01,83.06 IC1.8 | v59.69,86.36 59.48,86.36 58.84,87 58.84,90.67 57.81,91.71 55.93,91.71 RB0_C0.10
  Bottom 0.152: v41.43,85.09 42.12,85.78 56.16,85.78 56.8,86.41 IC2.17 59.64,86.41 v59.69,86.36
RB0_2  (via drill 0.35)
  Top 0.152: IC1.9 38.61,82.23 40.34,82.23 40.8,82.69 40.8,84.12 40.96,84.28 v41.43,84.28 | v60.33,85.72 59.05,85.72 58.54,86.24 58.54,90.55 57.69,91.4 54.33,91.4 52.39,93.34 52.39,95.25 RB0_C0.11
  Bottom 0.152: v41.43,84.28 42.6,85.45 56.32,85.45 56.64,85.76 IC2.16 58.42,85.72 v60.33,85.72
RB0_3  (via drill 0.35)
  Top 0.152: v41.43,83.48 41.43,82.52 40.38,81.46 IC1.10 | v59.69,85.09 58.58,85.09 58.24,85.43 58.24,90.42 57.56,91.1 54,91.1 RB0_C0.12
  Bottom 0.152: v41.43,83.48 43.07,85.11 IC2.15 58.41,85.09 v59.69,85.09
RB0_4  (via drill 0.35)
  Top 0.152: v60.33,84.45 58.58,84.45 57.93,85.1 57.93,90.3 57.44,90.79 52.4,90.79 49.85,93.34 49.85,95.25 RB0_C0.13 | IC1.13 v41.27,79.06
  Bottom 0.152: v41.27,79.06 42.07,79.85 42.07,81.12 44.46,83.51 54.89,83.51 55.84,84.46 IC2.14 60.32,84.46 v60.33,84.45
RB0_5  (via drill 0.35)
  Top 0.152: v59.69,83.82 58.42,83.82 57.63,84.61 57.63,90.17 57.31,90.49 52.07,90.49 RB0_C0.14 | v41.27,78.25 38.59,78.25 IC1.14
  Bottom 0.152: v41.27,78.25 42.39,79.36 42.39,80.96 44.6,83.18 55.05,83.18 55.68,83.81 IC2.13 v59.68,83.81 v59.69,83.82
RB0_6  (via drill 0.35)
  Top 0.152: v57.02,88.9 57.02,88.75 56.99,88.72 v56.99,83.16 | v41.27,77.44 38.6,77.44 IC1.15
  Bottom 0.152: IC2.12 v56.99,83.16 55.68,83.16 55.37,82.85 44.73,82.85 42.69,80.8 42.69,78.86 v41.27,77.44 | v57.02,88.9 57.34,89.22 57.34,90.17 55.3,92.21 48.44,92.21 47.31,93.34 47.31,95.25 RB0_C0.15
RB0_7  (via drill 0.35)
  Top 0.152: v41.27,76.64 41.25,76.66 IC1.16 | v56.69,89.85 56.44,89.6 v56.44,82.51
  Bottom 0.152: v41.27,76.64 43,78.36 43,80.68 44.83,82.51 v56.44,82.51 IC2.11 | v56.69,89.85 54.64,91.9 48.11,91.9 RB0_C0.16
RB0_8  (via drill 0.35)
  Top 0.152: IC1.29 53.96,76.66 54.93,77.63 v54.93,78.58 55.88,79.53 55.88,89.22 v55.88,89.85
  Bottom 0.152: IC14.18 55,78.65 v54.93,78.58 | v55.88,89.85 54.13,91.6 46.51,91.6 44.77,93.34 44.77,95.25 RB0_C0.17
RB0_9  (via drill 0.35)
  Top 0.152: IC1.30 53.81,77.46 v54.29,77.95 54.29,79.06 55.58,80.34 55.58,88.49 55.24,88.82 v55.24,89.3
  Bottom 0.152: IC14.17 54.35,78 v54.29,77.95 | v55.24,89.3 53.25,91.29 46.18,91.29 RB0_C0.18
RB0_10  (via drill 0.35)
  Top 0.152: IC1.31 v53.5,78.26 53.5,78.69 55.27,80.47 55.27,88.16 v54.44,88.99 | IC1.31
  Bottom 0.152: IC14.16 53.78,77.35 53.5,77.63 v53.5,78.26 | v54.44,88.99 52.44,90.99 44.58,90.99 42.23,93.34 42.23,95.25 RB0_C0.19
RB0_11  (via drill 0.35)
  Top 0.152: IC1.32 50.09,78.91 v52.86,78.91 54.97,81.01 54.97,86.88 53.63,88.21 v53.63,88.69
  Bottom 0.152: IC14.15 53.95,76.7 52.78,77.87 52.78,78.83 v52.86,78.91 | v53.63,88.69 51.63,90.68 44.25,90.68 RB0_C0.20
RB0_12  (via drill 0.35)
  Top 0.152: IC1.35 50.77,81.46 v52.55,79.69 53.21,79.69 54.66,81.14 54.66,86.55 v52.82,88.38
  Bottom 0.152: IC14.14 54.17,76.05 52.23,77.99 52.23,79.38 v52.55,79.69 | v52.82,88.38 50.83,90.38 42.65,90.38 39.69,93.34 39.69,95.25 RB0_C0.21
RB0_13  (via drill 0.35)
  Top 0.152: IC1.36 50.78,82.26 v52.55,80.5 53.58,80.5 54.36,81.28 54.36,85.75 v52.05,88.05
  Bottom 0.152: IC14.13 54.39,75.4 51.91,77.88 51.91,79.86 v52.55,80.5 | v52.05,88.05 50.03,90.08 42.32,90.08 RB0_C0.22
RB0_14  (via drill 0.35)
  Top 0.152: IC1.37 50.79,83.06 v52.55,81.31 53.6,81.31 54.05,81.76 54.05,85.26 v52.33,86.98
  Bottom 0.152: IC14.12 58.31,74.68 54.68,74.68 51.61,77.75 51.61,80.5 52.41,81.31 v52.55,81.31 | v52.33,86.98 49.55,89.77 40.72,89.77 37.15,93.34 37.15,95.25 RB0_C0.23
RB0_15  (via drill 0.35)
  Top 0.152: v53.34,81.92 51.39,83.86 | 51.39,83.86 51.28,83.86 IC1.38 | 51.39,83.86 51.39,86.95 v51.44,86.99
  Bottom 0.152: IC14.11 54.83,74.1 51.3,77.62 51.3,80.85 52.32,81.86 53.29,81.86 v53.34,81.92 | v51.44,86.99 48.96,89.47 40.39,89.47 RB0_C0.24
RB0_16  (via drill 0.35)
  Top 0.152: v39.69,70.17 39.69,63.98 39.57,63.86 IC15.7 38.62,63.82 37.78,63.82 36.99,64.61 36.99,90.96 34.61,93.34 34.61,95.25 RB0_C0.25
  Bottom 0.152: v39.69,70.17 39.76,70.24 IC8.18
RB0_17  (via drill 0.35)
  Top 0.152: v40.24,69.53 39.99,69.28 39.99,63.65 39.41,63.06 IC15.8 37.74,63.06 36.68,64.12 36.68,90.63 RB0_C0.26
  Bottom 0.152: IC8.17 55.84,69.59 55.52,69.9 40.62,69.9 v40.24,69.53
RB0_18  (via drill 0.35)
  Top 0.152: v40.55,68.72 40.3,68.47 40.3,63 39.56,62.26 IC15.9 37.5,62.26 36.29,63.48 36.29,88.6 36.29,89.12 32.07,93.34 32.07,95.25 RB0_C0.27
  Bottom 0.152: IC8.16 56,68.94 55.37,69.57 41.4,69.57 v40.55,68.72
RB0_19  (via drill 0.35)
  Top 0.152: v40.85,67.92 40.6,67.67 40.6,62.51 39.55,61.46 IC15.10 37.62,61.46 35.94,63.14 35.94,88.84 RB0_C0.28
  Bottom 0.152: IC8.15 56.16,68.29 55.21,69.24 42.17,69.24 v40.85,67.92
RB0_20  (via drill 0.35)
  Top 0.152: v41.16,67.11 40.91,66.86 40.91,60.12 39.85,59.05 IC15.13 37.46,59.06 35.56,60.96 35.56,87.33 29.53,93.37 29.53,95.25 RB0_C0.29
  Bottom 0.152: IC8.14 56.32,67.64 55.05,68.91 42.95,68.91 v41.16,67.11
RB0_21  (via drill 0.35)
  Top 0.152: 38.59,58.25 IC15.14 | v41.46,66.3 41.21,66.05 41.21,59.94 39.52,58.25 38.59,58.25 | 38.59,58.25 37.48,58.25 35.26,60.47 35.26,86.89 28.26,93.89 RB0_C0.30
  Bottom 0.152: IC8.13 56.48,66.99 54.89,68.57 43.73,68.57 v41.46,66.3
RB0_22  (via drill 0.35)
  Top 0.152: v41.77,65.5 41.52,65.25 41.52,59.45 39.5,57.44 38.6,57.44 IC15.15 37.47,57.46 37.15,57.78 34.95,59.98 34.95,66.67 34.95,86.29 31.65,89.59 30.07,91.17 29.16,91.17 26.99,93.34 26.99,95.25 RB0_C0.31
  Bottom 0.152: IC8.12 56.64,66.34 54.73,68.24 44.51,68.24 v41.77,65.5
RB0_23  (via drill 0.35)
  Top 0.152: v42.07,64.61 41.82,64.36 41.82,58.97 39.52,56.66 IC15.16 37.48,56.66 34.65,59.49 34.65,86.16 29.94,90.87 28.83,90.87 RB0_C0.32
  Bottom 0.152: IC8.11 56.8,65.69 54.57,67.91 45.37,67.91 v42.07,64.61
RB0_24  (via drill 0.35)
  Top 0.152: IC15.29 51.74,56.66 52.23,57.15 53.02,57.94 53.02,60.33 53.02,60.64 52.7,60.96 v51.75,60.96 | v34.09,63.18 34.09,64.77 34.34,65.02 34.34,86.04 29.81,90.56 27.23,90.56 24.45,93.34 24.45,95.25 RB0_C0.33
  Bottom 0.152: IC9.18 53.01,61.82 52.14,60.96 v51.75,60.96 51.28,60.96 50.64,60.33 36.51,60.33 35.36,61.48 35.36,61.91 v34.09,63.18
RB0_25  (via drill 0.35)
  Top 0.152: IC15.30 51.59,57.46 52.41,58.29 v52.41,60.31 | v34.09,62.38 33.53,62.93 33.53,64.81 34.04,65.31 34.04,85.91 29.73,90.22 | 29.73,90.22 29.69,90.26 | 29.69,90.26 29.73,90.22 | 29.69,90.26 26.9,90.26 RB0_C0.34
  Bottom 0.152: IC9.17 53.28,61.17 v52.41,60.31 51.46,60.31 51.14,59.99 36.1,59.99 35.04,61.05 35.04,61.42 v34.09,62.38
RB0_26  (via drill 0.35)
  Top 0.152: IC15.31 51.44,58.26 51.75,58.58 v51.75,59.66 | v34.09,61.57 33.23,62.43 33.23,64.93 33.73,65.44 33.73,85.78 29.56,89.95 25.3,89.95 21.91,93.34 21.91,95.25 RB0_C0.35
  Bottom 0.152: IC9.16 53.55,60.52 52.68,59.66 v51.75,59.66 35.84,59.66 34.73,60.77 34.73,60.93 v34.09,61.57
RB0_27  (via drill 0.35)
  Top 0.152: IC15.32 51.07,59.06 v51.12,59.01 | v34.09,60.76 32.92,61.93 32.92,65.06 33.43,65.56 33.43,85.66 29.43,89.65 24.97,89.65 RB0_C0.36
  Bottom 0.152: IC9.15 53.81,59.87 52.95,59.01 v51.12,59.01 35.9,59.01 34.15,60.76 v34.09,60.76
RB0_28  (via drill 0.35)
  Top 0.152: IC15.35 51.05,61.46 51.37,61.78 53.47,61.78 55.32,59.93 v55.32,59.22 | v34.09,59.95 32.62,61.42 32.62,65.19 33.12,65.69 33.12,85.53 29.31,89.34 23.37,89.34 19.37,93.34 19.37,95.25 RB0_C0.37
  Bottom 0.152: IC9.14 v55.32,59.22 54.08,59.22 53.22,58.36 36.12,58.36 34.52,59.95 v34.09,59.95
RB0_29  (via drill 0.35)
  Top 0.152: IC15.36 53.47,62.26 55.88,59.85 v55.88,58.57 | v34.09,59.15 32.31,60.92 32.31,65.31 32.82,65.81 32.82,85.4 29.18,89.04 23.04,89.04 RB0_C0.38
  Bottom 0.152: IC9.13 v55.88,58.57 54.35,58.57 53.49,57.71 36.02,57.71 34.58,59.15 v34.09,59.15
RB0_30  (via drill 0.35)
  Top 0.152: IC15.37 53.14,63.06 56.52,59.69 v56.52,57.92 | v34.09,58.34 32.01,60.42 32.01,65.44 32.51,65.94 32.51,85.28 29.05,88.73 21.44,88.73 16.83,93.34 16.83,95.25 RB0_C0.39
  Bottom 0.152: IC9.12 v56.52,57.92 54.62,57.92 53.76,57.06 35.76,57.06 34.48,58.34 v34.09,58.34
RB0_31  (via drill 0.35)
  Top 0.152: IC15.38 52.82,63.86 57.15,59.53 v57.15,57.27 | v34.13,57.47 31.7,59.89 31.7,65.56 32.21,66.07 32.21,85.15 28.93,88.43 21.11,88.43 RB0_C0.40
  Bottom 0.152: IC9.11 v57.15,57.27 54.89,57.27 54.03,56.41 35.19,56.41 v34.13,57.47
RB1_0  (via drill 0.35)
  Top 0.152: IC22.18 v31.27,41.95 35.44,41.95 37.51,44.02 IC13.7 39.57,44.02 40.01,44.45 v40.01,53.34 | RB1_C0.7 11.11,87.63 14.61,87.63 14.93,87.95 R33.1
  Bottom 0.152: v31.27,41.95 30.88,42.34 30.88,69.77 13.02,87.63 11.11,87.63 RB1_C0.7 | IC17.18 40.04,53.38 v40.01,53.34
RB1_1  (via drill 0.35)
  Top 0.152: IC22.17 v31.91,41.3 35.7,41.3 37.62,43.22 IC13.8 39.41,43.22 40.31,44.12 40.31,52.5 v40.56,52.75 | R34.1 RB1_C0.8
  Bottom 0.152: v31.91,41.3 30.96,41.3 30.57,41.68 30.57,68.17 RB1_C0.8 | IC17.17 56.97,52.73 56.62,53.07 40.88,53.07 v40.56,52.75
RB1_2  (via drill 0.35)
  Top 0.152: IC22.16 v30.96,40.65 35.8,40.65 37.56,42.42 IC13.9 39.56,42.42 40.62,43.47 40.62,51.7 v40.87,51.95 | R35.1 7.31,83.81 9.83,83.81 RB1_C0.9
  Bottom 0.152: v30.96,40.65 30.27,41.33 30.27,61.59 30.27,67.84 13.02,85.09 11.11,85.09 RB1_C0.9 | v40.87,51.95 41.69,52.77 56.45,52.77 57.15,52.07 IC17.16
RB1_3  (via drill 0.35)
  Top 0.152: IC22.15 v31.59,40 35.89,40 37.51,41.62 IC13.10 38.66,41.59 39.53,41.59 40.92,42.98 40.92,50.89 v41.17,51.14 | R36.1 RB1_C0.10
  Bottom 0.152: v31.59,40 30.8,40 29.97,40.83 29.97,66.24 RB1_C0.10 | IC17.15 57.36,51.43 56.33,52.46 42.49,52.46 v41.17,51.14
RB1_4  (via drill 0.35)
  Top 0.152: IC22.14 v30.96,39.35 36.22,39.35 36.35,39.21 IC13.13 39.85,39.22 41.22,40.59 41.22,50.08 v41.48,50.33 | RB1_C0.11 R37.1
  Bottom 0.152: v30.96,39.35 29.66,40.64 29.66,65.91 13.02,82.55 11.11,82.55 RB1_C0.11 | v41.48,50.33 43.3,52.16 55.31,52.16 56.7,50.78 IC17.14
RB1_5  (via drill 0.35)
  Top 0.152: IC22.13 22.05,38.73 v30.32,38.73 36.35,38.73 36.67,38.42 IC13.14 38.64,38.4 39.67,38.4 41.53,40.26 41.53,49.27 v41.78,49.53 | RB1_C0.12 R38.1
  Bottom 0.152: v30.32,38.73 29.36,39.7 29.36,64.31 RB1_C0.12 | IC17.13 56.91,50.13 55.19,51.85 44.11,51.85 v41.78,49.53
RB1_6  (via drill 0.35)
  Top 0.152: IC22.12 v29.69,38.05 35.93,38.05 36.36,37.62 IC13.15 39.68,37.62 41.83,39.77 41.83,48.47 v42.09,48.72 | RB1_C0.13 R39.1
  Bottom 0.152: v29.69,38.05 29.05,38.68 29.05,63.98 13.02,80.01 11.11,80.01 RB1_C0.13 | v42.09,48.72 44.91,51.55 55.06,51.55 57.13,49.48 IC17.12
RB1_7  (via drill 0.35)
  Top 0.152: IC22.11 v29.05,37.4 35.79,37.4 36.37,36.82 IC13.16 38.66,36.79 39.65,36.79 42.14,39.28 42.14,47.66 v42.39,47.91 | RB1_C0.14 R40.1
  Bottom 0.152: v29.05,37.4 28.75,37.7 28.75,62.38 RB1_C0.14 | IC17.11 57.35,48.83 54.94,51.24 45.72,51.24 v42.39,47.91
RB1_8  (via drill 0.35)
  Top 0.152: v56.67,44.93 56.67,41.27 52.22,36.82 IC13.29 48.76,36.82 v48.74,36.79 | v32.78,31.91 32.66,31.79 v28.73,31.79 IC23.18 | RB1_C0.15 R41.1
  Bottom 0.152: IC18.18 58.28,44.93 v56.67,44.93 | v48.74,36.79 43.64,36.79 38.76,31.91 v32.78,31.91 | v28.73,31.79 28.73,32.42 28.44,32.72 28.44,62.05 13.02,77.47 11.11,77.47 RB1_C0.15
RB1_9  (via drill 0.35)
  Top 0.152: v56.12,44.29 56.12,41.51 52.22,37.62 IC13.30 48.76,37.62 v48.74,37.6 | v33.34,32.54 33.34,31.61 32.86,31.14 v29.37,31.14 IC23.17 | R42.1 14.91,76.19 12.39,76.19 RB1_C0.16
  Bottom 0.152: IC18.17 58.3,44.29 v56.12,44.29 | v48.74,37.6 44.02,37.6 38.96,32.54 v33.34,32.54 | v29.37,31.14 28.42,31.14 28.14,31.42 28.14,60.45 RB1_C0.16
RB1_10  (via drill 0.35)
  Top 0.152: v55.56,43.66 55.56,41.75 52.23,38.42 IC13.31 49.98,38.4 v48.74,38.4 | v33.89,33.17 33.89,30.95 33.43,30.49 v28.57,30.49 IC23.16 | RB1_C0.17 R43.1
  Bottom 0.152: IC18.16 v55.56,43.66 | v48.74,38.4 44.39,38.4 39.16,33.17 v33.89,33.17 | v28.57,30.49 27.83,31.23 27.83,54.61 27.83,60.12 13.02,74.93 11.11,74.93 RB1_C0.17
RB1_11  (via drill 0.35)
  Top 0.152: v55.01,43.02 55.01,41.99 52.23,39.21 IC13.32 v48.74,39.22 v48.74,39.21 | v34.45,33.75 34.45,30.8 33.49,29.84 v27.94,29.84 IC23.15 | RB1_C0.18 R44.1
  Bottom 0.152: IC18.15 v55.01,43.01 v55.01,43.02 | v48.74,39.21 44.77,39.21 39.31,33.75 v34.45,33.75 | v27.94,29.84 27.53,30.25 27.53,58.52 RB1_C0.18
RB1_12  (via drill 0.35)
  Top 0.152: v54.45,42.39 53.68,41.62 IC13.35 48.79,41.62 v48.74,41.57 | v35,34.34 35,30.72 33.47,29.19 v28.57,29.19 IC23.14 | RB1_C0.19 R45.1
  Bottom 0.152: IC18.14 54.47,42.36 v54.45,42.39 | v48.74,41.57 46.66,41.57 39.44,34.34 v35,34.34 | v28.57,29.19 27.78,29.19 27.22,29.75 27.22,58.19 13.02,72.39 11.11,72.39 RB1_C0.19
RB1_13  (via drill 0.35)
  Top 0.152: v53.5,42.39 50.02,42.39 IC13.36 48.78,42.42 v48.74,42.37 | v35.56,34.92 35.56,30.64 33.46,28.54 v27.94,28.54 IC23.13 | R46.1 14.91,71.11 14.9,71.12 RB1_C0.20
  Bottom 0.152: IC18.13 53.85,41.71 53.5,42.07 v53.5,42.39 | v48.74,42.37 47.04,42.37 39.59,34.92 v35.56,34.92 | v27.94,28.54 26.92,29.56 26.92,54.45 26.92,56.59 RB1_C0.20
RB1_14  (via drill 0.35)
  Top 0.152: v53.5,43.19 50.02,43.19 IC13.37 49.95,43.18 v48.74,43.18 | v36.12,35.56 36.12,30.56 33.44,27.89 v27.3,27.89 IC23.12 | RB1_C0.21 R47.1
  Bottom 0.152: IC18.12 53.55,41.06 52.86,41.75 52.86,42.56 v53.5,43.19 | v36.12,35.56 39.8,35.56 47.42,43.18 v48.74,43.18 | v27.3,27.89 26.61,28.58 26.61,56.26 13.02,69.85 11.11,69.85 RB1_C0.21
RB1_15  (via drill 0.35)
  Top 0.152: v53.5,44 50.01,44 IC13.38 48.85,44.02 v48.74,44.13 | v36.67,36.2 36.67,30.16 33.75,27.24 v26.56,27.24 IC23.11 | R48.1 14.91,68.57 14.9,68.58 RB1_C0.22
  Bottom 0.152: IC18.11 53.77,40.41 52.56,41.62 52.56,43.06 v53.5,44 | v48.74,44.13 47.94,44.13 40,36.2 v36.67,36.2 | v26.56,27.24 26.31,27.49 26.31,54.65 RB1_C0.22
RB1_16  (via drill 0.35)
  Top 0.152: IC24.18 v25.88,21.63 34.77,21.63 35.28,21.63 37.31,23.65 37.31,24.13 v37.31,24.17 IC16.7 | RB1_C0.23 R49.1
  Bottom 0.152: IC19.18 52.29,36.55 50.86,35.12 42.58,35.12 39.78,32.31 39.78,26.6 37.35,24.17 v37.31,24.17 | v25.88,21.63 25.37,22.14 25.37,54.96 13.02,67.31 11.11,67.31 RB1_C0.23
RB1_17  (via drill 0.35)
  Top 0.152: IC24.17 v26.67,20.98 35.06,20.98 37.46,23.37 IC16.8 38.66,23.35 v39.83,23.35 | RB1_C0.24 R50.1
  Bottom 0.152: IC19.17 52.13,35.9 51.02,34.79 42.68,34.79 40.08,32.19 40.08,23.6 v39.83,23.35 | v26.67,20.98 25.72,20.98 25.06,21.63 25.06,53.36 RB1_C0.24
RB1_18  (via drill 0.35)
  Top 0.152: IC24.16 v27.3,20.33 34.84,20.33 37.09,22.57 IC16.9 38.66,22.54 v40.01,22.54 | RB1_C0.25 R51.1
  Bottom 0.152: IC19.16 51.97,35.25 51.17,34.46 42.78,34.46 40.39,32.06 40.39,22.92 v40.01,22.54 | v27.3,20.33 25.88,20.33 24.76,21.45 24.76,53.03 13.02,64.77 11.11,64.77 RB1_C0.25
RB1_19  (via drill 0.35)
  Top 0.152: IC24.15 v26.67,19.68 34.62,19.68 36.72,21.77 IC16.10 38.73,21.77 38.76,21.75 v40.44,21.75 | RB1_C0.26 R52.1
  Bottom 0.152: IC19.15 51.81,34.6 51.33,34.12 42.88,34.12 40.69,31.94 40.69,22 v40.44,21.75 | v26.67,19.68 26.04,19.68 24.45,21.26 24.45,51.43 RB1_C0.26
RB1_20  (via drill 0.35)
  Top 0.152: IC16.13 | IC24.14 v25.88,19.03 36.97,19.03 37.31,19.37 IC16.13 | v40.01,19.41 39.97,19.37 IC16.13 | RB1_C0.27 R53.1
  Bottom 0.152: IC19.14 53.87,33.95 52.76,32.84 42.02,32.84 41,31.81 41,20.4 v40.01,19.41 | v25.88,19.03 24.15,20.75 24.15,51.1 13.02,62.23 11.11,62.23 RB1_C0.27
RB1_21  (via drill 0.35)
  Top 0.152: IC24.13 v25.08,18.38 35.24,18.38 37.11,18.38 37.31,18.57 IC16.14 39.98,18.57 v40.01,18.6 | RB1_C0.28 R54.1
  Bottom 0.152: IC19.13 53.72,33.3 52.92,32.51 42.12,32.51 41.3,31.68 41.3,19.37 40.53,18.6 v40.01,18.6 | v25.08,18.38 23.84,19.62 23.84,50.36 13.24,60.96 RB1_C0.28
RB1_22  (via drill 0.35)
  Top 0.152: IC24.12 v24.45,17.73 36.59,17.73 38.58,17.73 IC16.15 38.65,17.75 39.97,17.75 v40.01,17.79 | RB1_C0.29 R55.1
  Bottom 0.152: IC19.12 53.56,32.65 53.08,32.17 42.22,32.17 41.6,31.56 41.6,19.02 40.38,17.79 v40.01,17.79 | v24.45,17.73 23.54,18.64 23.54,50.23 14.08,59.69 11.11,59.69 RB1_C0.29
RB1_23  (via drill 0.35)
  Top 0.152: IC24.11 v23.65,17.08 37.15,17.08 38.63,17.08 IC16.16 39.99,16.97 v40.01,16.99 | RB1_C0.30 R56.1
  Bottom 0.152: IC19.11 53.56,32 53.4,31.84 42.32,31.84 41.91,31.43 41.91,18.89 v40.01,16.99 | v23.65,17.08 23.23,17.5 23.23,50.11 R56.1 RB1_C0.30
RB1_24  (via drill 0.35)
  Top 0.152: v56.83,28.1 56.83,22.7 51.1,16.97 IC16.29 48.74,16.97 v48.58,16.81 | v33.1,11.95 32.62,11.47 v25.88,11.47 IC25.18 | RB1_C0.31 R57.1
  Bottom 0.152: IC20.18 56.87,28.14 v56.83,28.1 | v48.58,16.81 44.12,16.81 39.25,11.95 v33.1,11.95 | v25.88,11.47 24.29,11.47 22.93,12.83 22.93,46.76 12.54,57.15 11.11,57.15 RB1_C0.31
RB1_25  (via drill 0.35)
  Top 0.152: v56.28,27.46 56.28,22.62 51.43,17.77 IC16.30 49.84,17.62 v48.58,17.62 | v33.65,12.53 33.65,11.43 33.04,10.82 v25.24,10.82 IC25.17 | RB1_C0.32 R58.1
  Bottom 0.152: IC20.17 56.3,27.49 v56.28,27.46 | v48.58,17.62 44.5,17.62 39.41,12.53 v33.65,12.53 | v25.24,10.82 24.45,10.82 22.62,12.64 22.62,46.64 13.38,55.88 RB1_C0.32
RB1_26  (via drill 0.35)
  Top 0.152: v55.72,26.83 55.72,22.54 51.75,18.57 IC16.31 49.98,18.56 v48.58,18.56 | v34.21,13.12 34.21,11.03 33.34,10.17 v24.61,10.17 IC25.16 | RB1_C0.33 R59.1
  Bottom 0.152: IC20.16 v55.73,26.84 v55.72,26.83 | v48.58,18.56 45,18.56 39.56,13.12 v34.21,13.12 | v24.61,10.17 22.32,12.45 22.32,46.51 14.22,54.61 11.11,54.61 RB1_C0.33
RB1_27  (via drill 0.35)
  Top 0.152: v55.16,26.19 55.16,22.46 52.07,19.37 IC16.32 v48.58,19.37 | v34.77,13.7 34.77,10.64 33.65,9.52 v23.97,9.52 IC25.15 | RB1_C0.34 R60.1
  Bottom 0.152: IC20.15 55.17,26.19 v55.16,26.19 | v48.58,19.37 45.38,19.37 39.72,13.7 v34.77,13.7 | v23.97,9.52 22.02,11.47 22.02,46.38 15.06,53.34 RB1_C0.34
RB1_28  (via drill 0.35)
  Top 0.152: v54.61,25.56 54.61,23.49 52.89,21.77 IC16.35 49.94,21.72 v48.58,21.72 | v35.32,14.29 35.32,10.08 34.11,8.87 v24.61,8.87 IC25.14 | RB1_C0.35 R61.1
  Bottom 0.152: IC20.14 54.63,25.54 v54.61,25.56 | v48.58,21.72 47.3,21.72 41.6,16.02 39.87,14.29 v35.32,14.29 | v24.61,8.87 23.5,8.87 21.71,10.65 21.71,46.26 15.9,52.07 11.11,52.07 RB1_C0.35
RB1_29  (via drill 0.35)
  Top 0.152: v54.05,24.92 54.05,23.57 53.02,22.54 50.02,22.54 IC16.36 49.95,22.53 v48.58,22.53 | v35.88,14.92 35.88,9.84 34.25,8.22 v23.97,8.22 IC25.13 | RB1_C0.36 R62.1
  Bottom 0.152: IC20.13 54.09,24.89 v54.05,24.92 | v48.58,22.53 47.68,22.53 40.07,14.92 v35.88,14.92 | v23.97,8.22 23.5,8.22 21.41,10.31 21.41,46.13 16.74,50.8 RB1_C0.36
RB1_30  (via drill 0.35)
  Top 0.152: v53.5,24.29 53.5,23.65 53.18,23.34 50.03,23.34 IC16.37 49.95,23.34 v48.58,23.34 | v36.51,15.56 36.51,9.53 34.55,7.57 v24.61,7.57 IC25.12 | RB1_C0.37 R63.1
  Bottom 0.152: IC20.12 53.55,24.24 v53.5,24.29 | v48.58,23.34 48.06,23.34 40.28,15.56 v36.51,15.56 | v24.61,7.57 23.65,7.57 21.1,10.12 21.1,46.01 17.58,49.53 11.11,49.53 RB1_C0.37
RB1_31  (via drill 0.35)
  Top 0.152: v52.69,24.29 52.58,24.17 IC16.38 48.69,24.17 v48.58,24.29 | v37.15,16.19 37.15,8.89 35.17,6.92 v23.97,6.92 IC25.11 | RB1_C0.38 R64.1
  Bottom 0.152: IC20.11 53.39,23.59 v52.69,24.29 | v37.15,16.19 40.48,16.19 v48.58,24.29 | v23.97,6.92 23.81,6.92 20.8,9.93 20.8,45.88 18.41,48.26 RB1_C0.38
RF_CLK  (via drill 0.35)
  Top 0.152: IC5.10 72.71,6.03 73.34,6.67 73.34,13.18 73.01,13.51 73.01,39.82 73.84,40.65 73.84,45.4 76.39,47.95 76.39,50.96 v76.7,51.28
  Bottom 0.152: v76.7,51.28 75.73,50.3 IC28.4
RF_LOAD  (via drill 0.35)
  Top 0.152: IC5.13 IC5.2 76.52,10.91 73.62,13.8 73.62,27.43 74.3,28.1 74.3,45.42 76.69,47.82 76.69,50.33 77.31,50.95 v77.31,55.88
  Bottom 0.152: v77.31,55.88 SIGNAL_C0.3
RF_STR  (via drill 0.35)